# EAGLE design high_pwr_regulator (EAGLE 9.7.0)
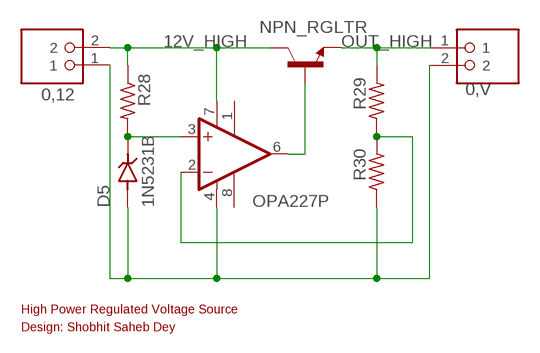
[diagram p0: schematic, sheet 1]

## Parts
0,12  1935161  [PHOENIX_1935161]
0,V  1935161  [PHOENIX_1935161]
D5  1N5231B  [DIOAD928W47L399D179]
NPN_RGLTR  NJD2873T4G  [TO229P990X238-3N]
OP_FAN  OPA227P  [DIL08]
R28  R-US_0411/3V  [0411V]
R29  R-US_0411/3V  [0411V]
R30  R-US_0411/3V  [0411V]

## Nets
12V_HIGH [Fan]: 0,12.2 NPN_RGLTR.4(C) OP_FAN.7(V+) R28.1
GND [Fan]: 0,12.1 0,V.2 D5.A OP_FAN.4(V-) R30.1
N$44: D5.C(K) OP_FAN.3(+IN) R28.2
N$45: OP_FAN.2(-IN) R29.1 R30.2
N$47: NPN_RGLTR.1(B) OP_FAN.6(OUT)
OUT_HIGH [Fan]: 0,V.1 NPN_RGLTR.3(E) R29.2
Unconnected: OP_FAN.1(OFF1) OP_FAN.8(OFF2)

## Notes on the sheet
- High Power Regulated Voltage Source
- Design: Shobhit Saheb Dey

## Library data of the parts
0,12 0,V = 1935161:1935161: Check availability <https://pricing.snapeda.com/parts/1935161/Phoenix%20Contact/view-part?ref=eda>; AVAILABILITY: In Stock; CHECK_PRICES: https://www.snapeda.com/parts/1935161/Phoenix+Contact/view-part/?ref=eda; DESCRIPTION: PCB Terminal Screw 5mm 16AWG 400V 17.5A 2 Position COMBICON PT Series | Phoenix Contact 1935161; MF: Phoenix Contact; MP: 1935161; PACKAGE: None; PRICE: None; PURCHASE-URL: https://www.snapeda.com/api/url_track_click_mouser/?unipart_id=423515&manufacturer=Phoenix Contact&part_name=1935161&search_term=1935161; SNAPEDA_LINK: https://www.snapeda.com/parts/1935161/Phoenix+Contact/view-part/?ref=snap
D5 = 1N5231B:1N5231B: Check availability <https://pricing.snapeda.com/parts/1N5231B/Taiwan%20Semiconductor/view-part?ref=eda>; AVAILABILITY: In Stock; CHECK_PRICES: https://www.snapeda.com/parts/1N5231B/Taiwan+Semiconductor/view-part/?ref=eda; DESCRIPTION: Zener Diode Single 5.1V 5% 17Ohm 500mW 2-Pin DO-35 T/R; MF: Taiwan Semiconductor; MP: 1N5231B; PACKAGE: DO-35-2 Taiwan Semiconductor; PRICE: None; SNAPEDA_LINK: https://www.snapeda.com/parts/1N5231B/Taiwan+Semiconductor/view-part/?ref=snap
NPN_RGLTR = NJD2873T4G:NJD2873T4G: Check availability <https://pricing.snapeda.com/parts/NJD2873T4G/ON%20Semiconductor/view-part?ref=eda> Check availability <https://pricing.snapeda.com/parts/NJD2873T4G/ON%20Semiconductor/view-part?ref=eda>; AVAILABILITY: In Stock; CHECK_PRICES: https://www.snapeda.com/parts/NJD2873T4G/Onsemi/view-part/?ref=eda; DESCRIPTION: ON Semi NJD2873T4G NPN Bipolar Transistor, 2 A, 50 V, 3-Pin DPAK | ON Semiconductor NJD2873T4G; MF: ON Semiconductor; MP: NJD2873T4G; PACKAGE: DPAK-3 ON Semiconductor; PRICE: None; PURCHASE-URL: https://www.snapeda.com/api/url_track_click_mouser/?unipart_id=371921&manufacturer=ON Semiconductor&part_name=NJD2873T4G&search_term=njd2873t4g; SNAPEDA_LINK: https://www.snapeda.com/parts/NJD2873T4G/Onsemi/view-part/?ref=snap
OP_FAN = linear:OPA22*: High Precision, Low Noise OPERATIONAL AMPLIFIERS Source: http://focus.ti.com/lit/ds/symlink/opa227.pdf
R28-R30 = rcl:R-US_: RESISTOR, American symbol; SPICEPREFIX: R

## Net classes
0 default: width 0.254 mm, clearance 0.254 mm
4 Fan: width 1.27 mm, clearance 0.254 mm

## Board
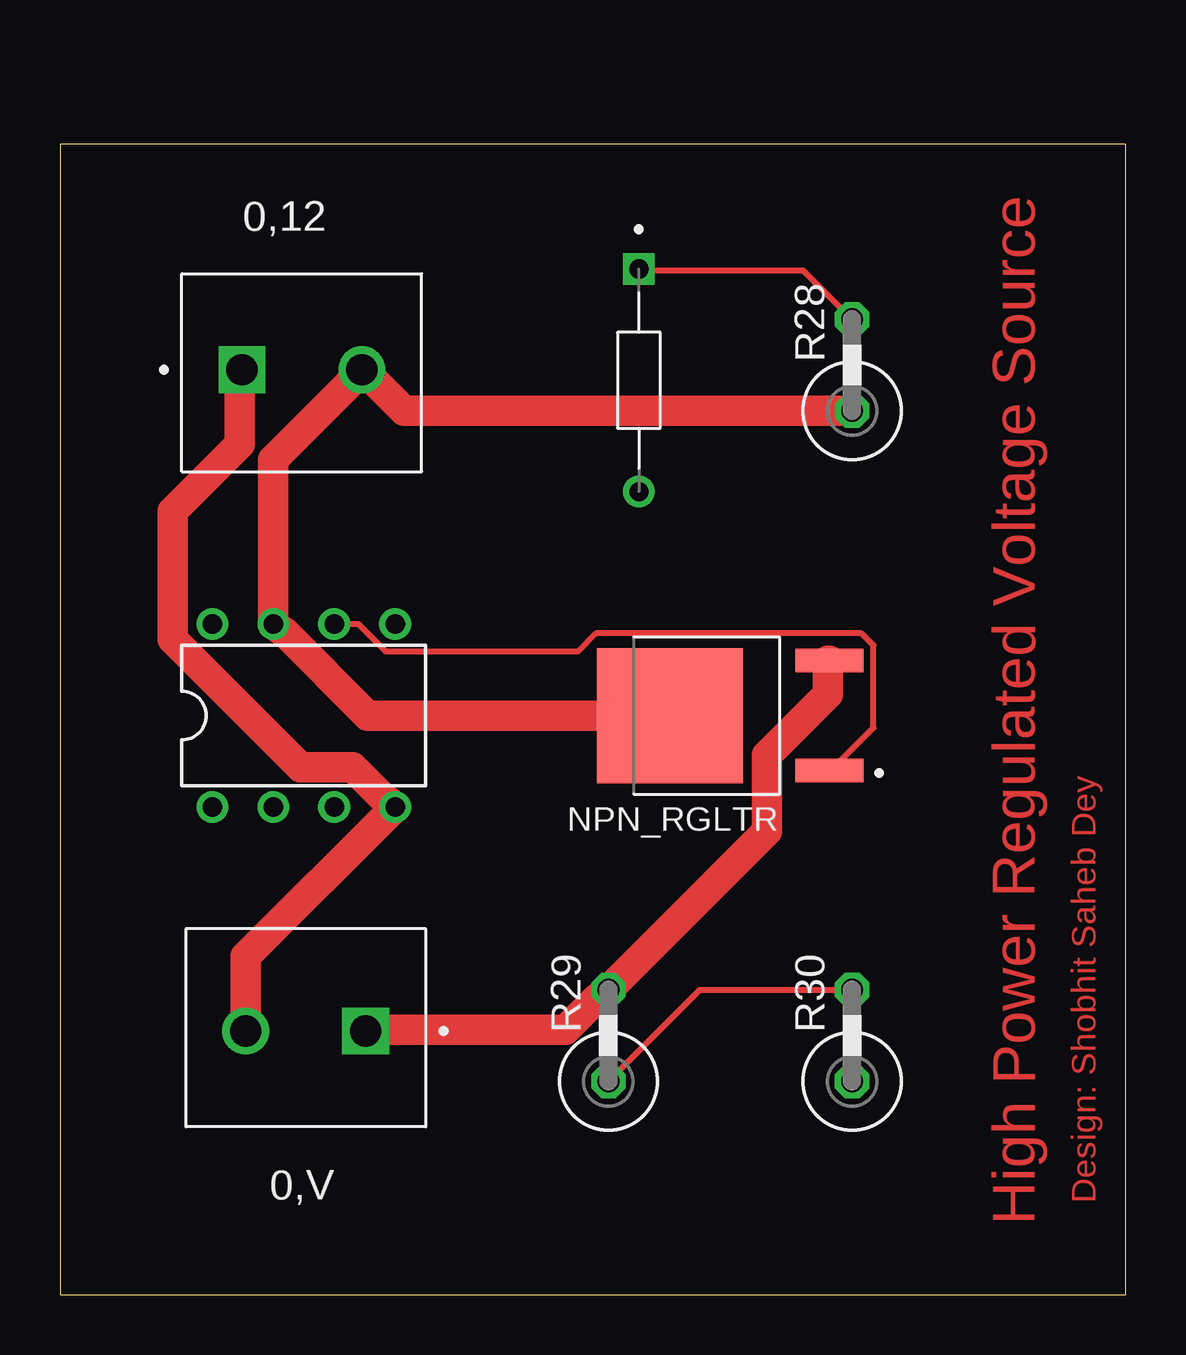
[diagram p1: board, top side]
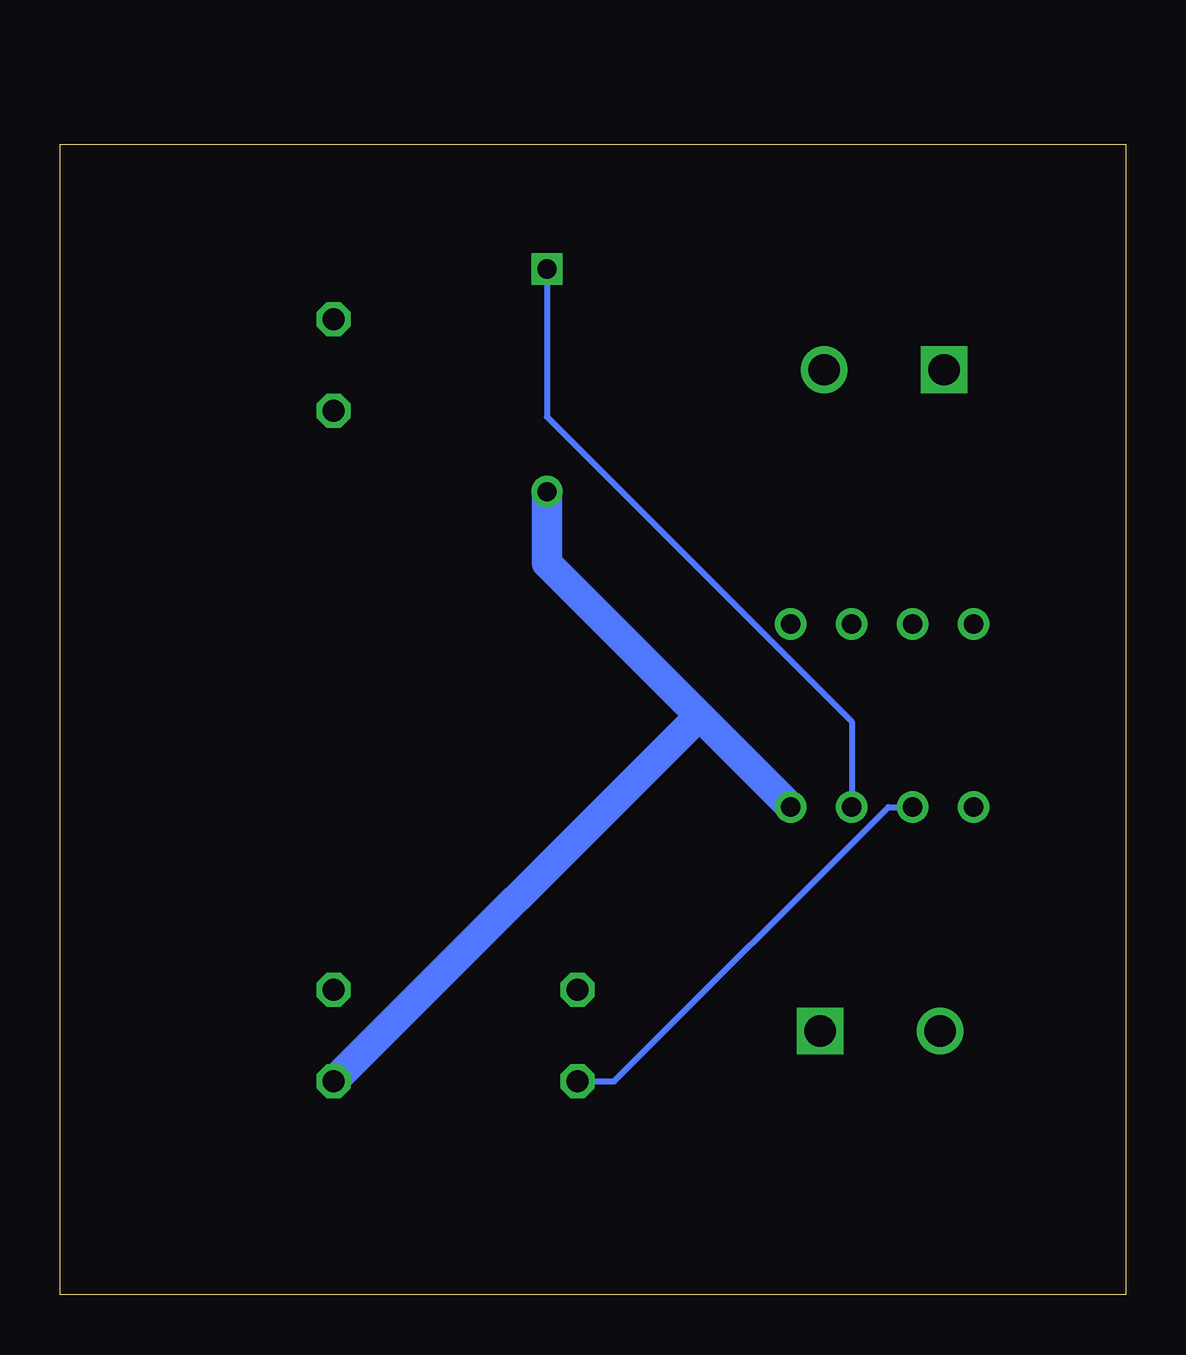
[diagram p2: board, bottom side, seen from below]

Size 44.43 x 47.93 mm. Coordinates in mm from the lower left corner, seen from the top.
Outline: 0,0 44.43,0 44.43,47.93 0,47.93 0,0
Copper layers (1*16): Top 0.035mm / dielectric 1.5mm / Bottom 0.035mm
Design rules "default": minimum track width 6mil, minimum drill 0.35mm, track to track 6mil, track to pad 6mil, pad to pad 6mil, via to via 6mil, smd to smd 6mil, copper to edge 40mil, drill to drill 6mil, minimum pad ring 10mil, minimum via ring 8mil, stop-mask expansion 4mil, vias tented up to drill 0mil, thermal gap 10mil

### Footprints (pad centres in the part's own frame; a part is rotated, then mirrored left to right if it is on the bottom)
PHOENIX_1935161 = drill 1.3 square: 1 2.5,4.25 | drill 1.3: 2 7.5,4.25
DIOAD928W47L399D179 = drill 0.8: A 4.64,0 | drill 0.8 square: C -4.64,0
TO229P990X238-3N = smd 2.83 x 0.97: 1 -4.14,2.29; 3 -4.14,-2.29 | smd 6.09 x 5.63: 4 2.51,0
DIL08 = drill 0.813 pad 1.27: 1 -3.81,-3.81; 2 -1.27,-3.81; 3 1.27,-3.81; 4 3.81,-3.81; 5 3.81,3.81; 6 1.27,3.81; 7 -1.27,3.81; 8 -3.81,3.81
0411V = drill 0.914 octagon: 1 -2.54,0; 2 1.27,0

### Placement (x,y rotation side)
0,12  5.08,34.29 0 top
0,V  15.24,15.24 180 top
D5  24.13,38.1 270 top
NPN_RGLTR  27.94,24.13 180 top
OP_FAN  10.16,24.13 0 top
R28  33.02,39.37 90 top
R29  22.86,11.43 90 top
R30  33.02,11.43 90 top

### Tracks (layer width: path | path; a pad name or v marks a point on that pad's centre or on a via)
12V_HIGH
  Top 1.27: R28.1 14.35,36.83 13.08,38.1 0,12.2 12.57,38.48 8.89,34.8 OP_FAN.7 9.4,27.56 12.83,24.13 NPN_RGLTR.4
GND
  Top 1.27: 0,V.2 7.75,11.05 7.75,14.1 OP_FAN.4 13.46,20.7 12.19,21.97 10.03,21.97 4.7,27.3 4.7,32.64 7.49,35.43 7.49,38.48 0,12.1
  Bottom 1.27: D5.A 24.13,30.48 17.78,24.13 | OP_FAN.4 17.78,24.13 | 17.78,24.13 R30.1
N$44
  Top 0.254: R28.2 30.99,42.67 24.13,42.67 D5.C
  Bottom 0.254: OP_FAN.3 11.43,23.88 24.13,36.58 D5.C
N$45
  Top 0.254: R30.2 26.67,12.7 R29.1
  Bottom 0.254: OP_FAN.2 9.91,20.32 21.34,8.89 R29.1
N$47
  Top 0.254: OP_FAN.6 12.45,27.94 13.59,26.8 21.59,26.8 22.35,27.56 33.4,27.56 33.91,27.05 33.91,23.62 32.13,21.84 NPN_RGLTR.1
OUT_HIGH
  Top 1.27: NPN_RGLTR.3 32,26.42 32,25.02 29.46,22.48 29.46,19.3 R29.2 22.35,12.32 21.08,11.05 12.83,11.05 0,V.1

### Text on the board
Top: Design: Shobhit Saheb Dey | High Power Regulated Voltage Source